# Altium schematic sheet Supply 5V to 3V3- Ams1117.SchDoc
size A
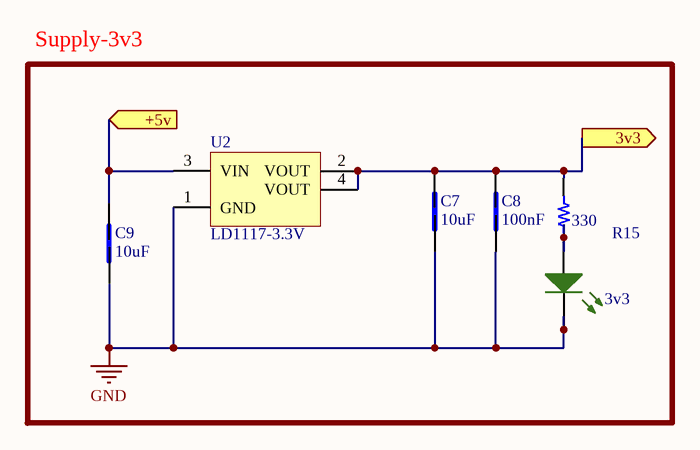
[diagram p0: Supply 5V to 3V3- Ams1117.SchDoc]

## Parts
3v3  LED SMD 0805 GREEN  [LED_0805_GREEN]  (value not drawn)
C7  10uF  [CAP 0805_2012]
C8  100nF  [CAP 0805_2012]
C9  10uF  [CAP 0805_2012]
R15  330  [RES 0805_2012]
U2  LD1117-3.3V  [SOT-223-4 6.5X7MM P2.3MM]

## Blocks framed on the sheet
Supply-3v3: 3v3 C7-C9 R15 U2

## Ports
3v3 (out), +5v (in)

## Nets
GND: 3v3.2(K) C7.1 C8.1 C9.1 U2.1(GND)
3v3: C7.2 C8.2 R15.1 U2.2(VOUT) U2.4(VOUT) ; port 3v3
+5v: C9.2 U2.3(VIN) ; port +5v
Net3v3_1: 3v3.1(A) R15.2

## Library data of the parts
C7-C9 = LD051C182KAB2A: COMMERCIAL CHIP STD JAPAN BULK - FN TAPE/REEL, 7 INCH PAPER TAPE-0805; Package: None; Price: None; Value: *; MP: LD051C182KAB2A; Availability: Unavailable
R15 = Res 0805: SMT Resistor; VALUE: 1K
U2 = LD1117-3.3V (SMD SOT-223): Linear Voltage Regulator IC  1 Output  800mA SOT-223; PartNumber: LD1117S33CTR